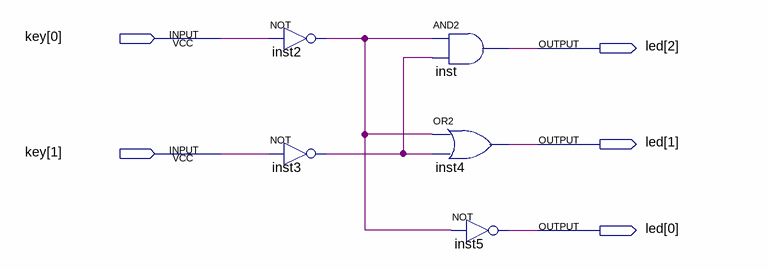
[diagram p0: schematic sheet]
// Quartus schematic first_project.bdf as structural Verilog: 5 symbols, 5 pins
module first_project (
  input  [1:0] key,
  output [2:0] led
);

  wire inst2_out, inst3_out;

  not inst2 (inst2_out, key[0]);
  not inst3 (inst3_out, key[1]);
  and inst (led[2], inst2_out, inst3_out);
  or inst4 (led[1], inst2_out, inst3_out);
  not inst5 (led[0], inst2_out);
endmodule
